# Altium schematic sheet 13 HEADERS.SchDoc
size 513 x 386 mm
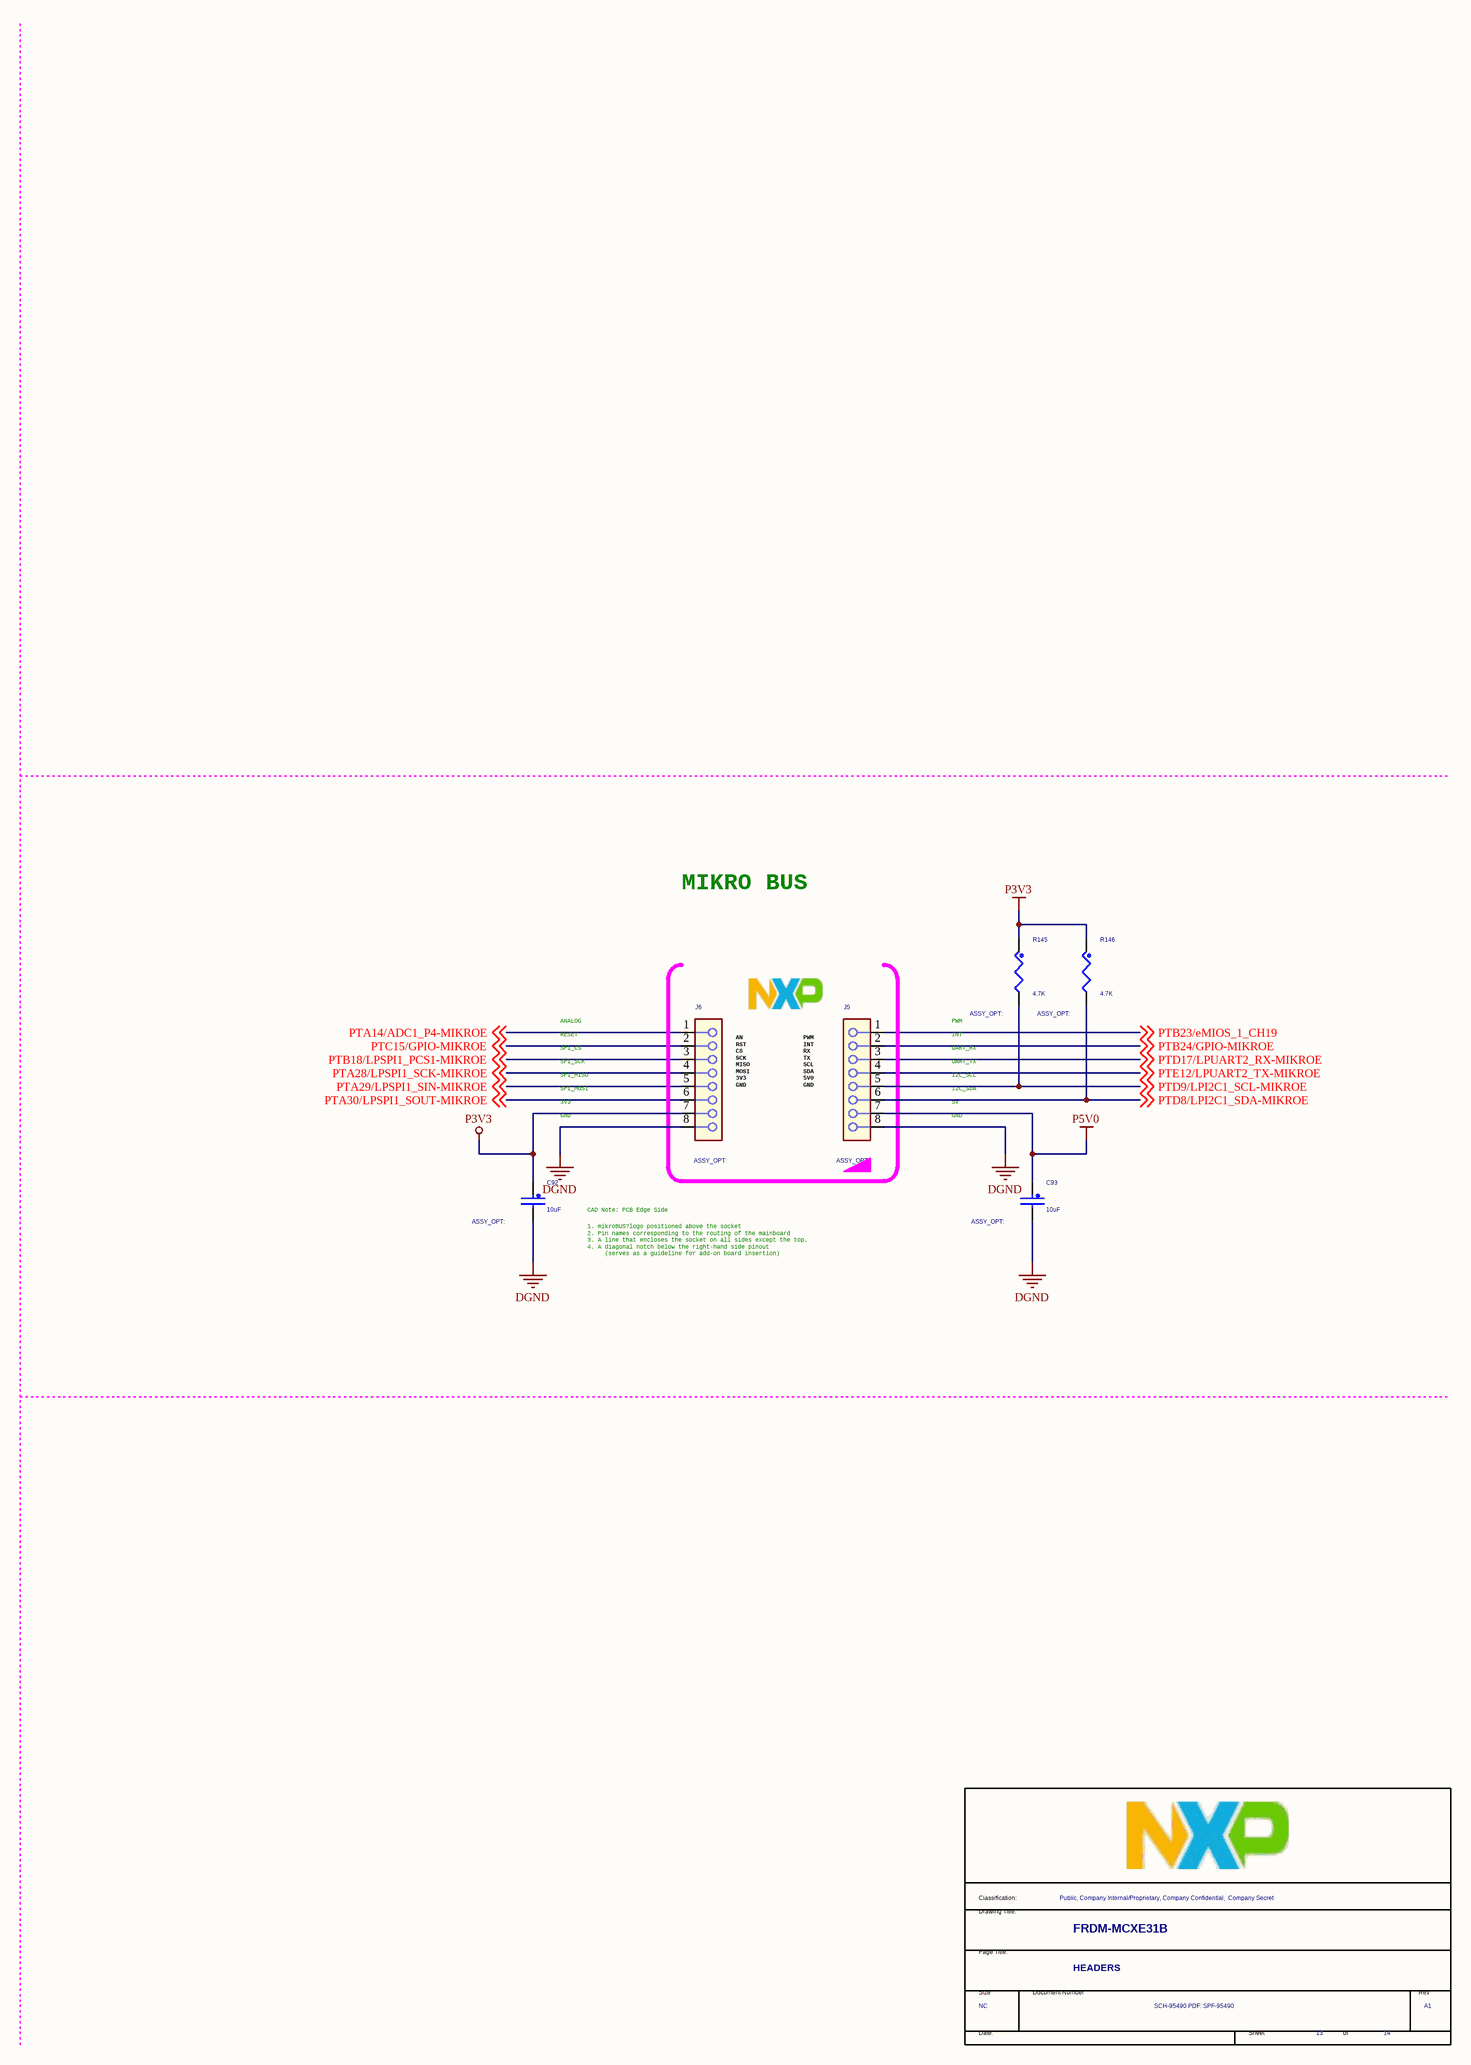
[diagram p0: 13 HEADERS.SchDoc]

## Parts
*  Title: FRDM-MCXE31B  RevCode: A1  PageTitle: HEADERS  Page Size: NC  Page Number: 13  Page Count: 14  Doc: SCH-95490 PDF: SPF-95490  Classification: Public, Company Internal/Proprietary, Company Confidential,  Company Secret  (hidden comment: TitleBlock_FS)  (graphical)
C92  10uF  [CC0603_OV]
C93  10uF  [CC0603_OV]
J5  SKT_1X8  [con_1x8_skt_2p54_th_126l]  (value not drawn)
J6  SKT_1X8  [con_1x8_skt_2p54_th_126l]  (value not drawn)
R145  4.7K  [RC0402_25]
R146  4.7K  [RC0402_25]

## Nets
DGND: C92.2 C93.2 J5.8 J6.8
P3V3: C92.1 J6.7 R145.1 R146.1
P5V0: C93.1 J5.7
PTA14/ADC1_P4-MIKROE: J6.1 ; off-sheet PTA14/ADC1_P4-MIKROE
PTA28/LPSPI1_SCK-MIKROE: J6.4 ; off-sheet PTA28/LPSPI1_SCK-MIKROE
PTA29/LPSPI1_SIN-MIKROE: J6.5 ; off-sheet PTA29/LPSPI1_SIN-MIKROE
PTA30/LPSPI1_SOUT-MIKROE: J6.6 ; off-sheet PTA30/LPSPI1_SOUT-MIKROE
PTB18/LPSPI1_PCS1-MIKROE: J6.3 ; off-sheet PTB18/LPSPI1_PCS1-MIKROE
PTB23/eMIOS_1_CH19: J5.1 ; off-sheet PTB23/eMIOS_1_CH19
PTB24/GPIO-MIKROE: J5.2 ; off-sheet PTB24/GPIO-MIKROE
PTC15/GPIO-MIKROE: J6.2 ; off-sheet PTC15/GPIO-MIKROE
PTD8/LPI2C1_SDA-MIKROE: J5.6 R146.2 ; off-sheet PTD8/LPI2C1_SDA-MIKROE
PTD9/LPI2C1_SCL-MIKROE: J5.5 R145.2 ; off-sheet PTD9/LPI2C1_SCL-MIKROE
PTD17/LPUART2_RX-MIKROE: J5.3 ; off-sheet PTD17/LPUART2_RX-MIKROE
PTE12/LPUART2_TX-MIKROE: J5.4 ; off-sheet PTE12/LPUART2_TX-MIKROE

## Notes on the sheet
- MIKRO BUS
- socket board
- ANALOG
- RESET
- SPI_CS
- SPI_SCK
- PWM
- INT
- UART_RX
- UART_TX
- SPI_MISO
- SPI_MOSI
- 3V3
- GND
- (near J6) AN
  RST
  CS
  SCK
  MISO
  MOSI
  3V3
  GND
- (near J5) PWM
  INT
  RX
  TX
  SCL
  SDA
  5V0
  GND
- I2C_SCL
- I2C_SDA
- 5V
- CAD Note: PCB Edge Side
- (near C93) 1. mikroBUS?logo positioned above the socket
  2. Pin names corresponding to the routing of the mainboard
  3. A line that encloses the socket on all sides except the top.
  4. A diagonal notch below the right-hand side pinout
  (serves as a guideline for add-on board insertion)
- (in symbol TitleBlock_FS) Classification:; Drawing Title:; Page Title:; Size; Document Number; Rev; Date:; Sheet; of

## Library data of the parts
* = TitleBlock_FS: Classification: Company Internal/Proprietary; OrgName: NXP Semiconductors; OrgAddr1: 6501 William Cannon Drive West; OrgAddr2: Austin, TX 78735-8598; Variant Name: <Core Design>; Page Create Date: March  8, 1995
C92 = CAP_NP: CAP CER 10uF 25V 20% X5R 0603; CLASS: DISCRETE; FPLIST: CC0603_OV,CC0603,0603_cc_tol; MFG_PN01: GRM188R61E106MA73D; MFG_NAME01: MURATA; Temp Range: -55C to +85C; CAD_APPROVED: Yes; AGILE_PN: 150-79272; ROHS: Yes; Rated Voltage: 25V; Tolerance: 20%; HEIGHT: 1; Package Size: 0603
C93 = CAP_NP: CAP CER 10uF 25V 20% X5R 0603; CLASS: DISCRETE; AGILE_PN: 150-79272; CAD_APPROVED: Yes; Temp Range: -55C to +85C; MFG_NAME01: MURATA; MFG_PN01: GRM188R61E106MA73D; FPLIST: CC0603_OV,CC0603,0603_cc_tol; Package Size: 0603; HEIGHT: 1; Tolerance: 20%; Rated Voltage: 25V; ROHS: Yes
J5 J6 = CONN_HDR_8X1: CON 1X8 SKT TH 100MIL SP 344H AU 118L; CLASS: IO; MFG_PN01: 08001S3 0811-29RF; MFG_NAME01: ANYTRONIC CORPORATION LIMITED; Temp Range: -40°C to +105°C; CAD_APPROVED: Yes; FPLIST: con_1x8_skt_2p54_th_126l,con_1x8_skt_2p54_th; AGILE_PN: 210-81617; 3D_Mechanical_Footprint_File: http://fcl.am.freescale.net/ALLEGRO/step/con_1x8_skt_2p54_th_126l.STEP; ROHS: NULL; HEIGHT: 8.75mm
R145 R146 = RES: RES MF 4.7K 1/16W 5% 0402; CLASS: DISCRETE; Pkg: 0402; AGILE_PN: 470-75626; FPLIST: RC0402_25,RC0402_HD,0402_CC,RC0402_X2; CAD_APPROVED: Yes; MFG_NAME01: BOURNS; MFG_PN01: CR0402-JW-472GLF; HEIGHT: 0.41; Tolerance: 5%; ROHS: NULL